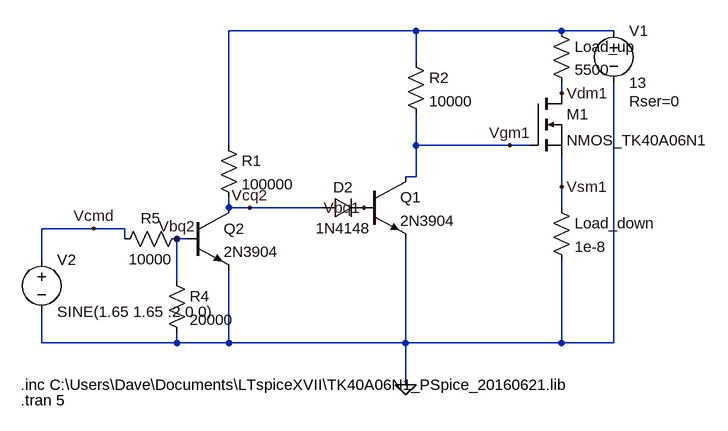
[diagram p0: schematic Acourse_MOSFET_201710112.asc]
Acourse_MOSFET_201710112.asc, the LTspice schematic file:
Version 4
SHEET 1 984 680
WIRE 320 -32 32 -32
WIRE 544 -32 320 -32
WIRE 624 -32 544 -32
WIRE 320 16 320 -32
WIRE 544 64 544 48
WIRE 32 144 32 -32
WIRE 320 144 320 96
WIRE 464 144 320 144
WIRE 496 144 464 144
WIRE 320 192 320 144
WIRE 320 192 304 192
WIRE 544 208 544 160
WIRE 32 240 32 224
WIRE 64 240 32 240
WIRE 176 240 64 240
WIRE 544 240 544 208
WIRE -176 272 -256 272
WIRE -128 272 -176 272
WIRE -128 288 -128 272
WIRE -32 288 -48 288
WIRE -256 320 -256 272
WIRE -48 352 -48 288
WIRE -256 448 -256 400
WIRE -48 448 -48 432
WIRE -48 448 -256 448
WIRE 32 448 32 336
WIRE 32 448 -48 448
WIRE 304 448 304 288
WIRE 304 448 32 448
WIRE 544 448 544 320
WIRE 544 448 304 448
WIRE 624 448 624 48
WIRE 624 448 544 448
WIRE 304 512 304 448
FLAG 304 512 0
FLAG -48 288 Vbq2
FLAG 240 240 Vbq1
FLAG 464 144 Vgm1
FLAG -176 272 Vcmd
FLAG 544 208 Vsm1
FLAG 544 64 Vdm1
FLAG 64 240 Vcq2
SYMBOL res 16 128 R0
SYMATTR InstName R1
SYMATTR Value 100000
SYMBOL res 304 0 R0
SYMATTR InstName R2
SYMATTR Value 10000
SYMBOL diode 176 256 R270
WINDOW 0 32 32 VTop 2
WINDOW 3 0 32 VBottom 2
SYMATTR InstName D2
SYMATTR Value 1N4148
SYMBOL npn 240 192 R0
SYMATTR InstName Q1
SYMATTR Value 2N3904
SYMBOL res 528 224 R0
SYMATTR InstName Load_down
SYMATTR Value 1e-8
SYMATTR SpiceLine pwr=200
SYMBOL voltage 624 -48 R0
WINDOW 123 0 0 Left 2
WINDOW 39 24 124 Left 2
SYMATTR SpiceLine Rser=0
SYMATTR InstName V1
SYMATTR Value 13
SYMBOL npn -32 240 R0
SYMATTR InstName Q2
SYMATTR Value 2N3904
SYMBOL res -64 336 R0
SYMATTR InstName R4
SYMATTR Value 20000
SYMBOL res -32 272 R90
WINDOW 0 0 56 VBottom 2
WINDOW 3 32 56 VTop 2
SYMATTR InstName R5
SYMATTR Value 10000
SYMBOL voltage -256 304 R0
WINDOW 123 0 0 Left 2
WINDOW 39 0 0 Left 2
SYMATTR InstName V2
SYMATTR Value SINE(1.65 1.65 .2 0 0)
SYMBOL nmos 496 64 R0
SYMATTR InstName M1
SYMATTR Value NMOS_TK40A06N1
SYMATTR Prefix X
SYMBOL res 528 -48 R0
SYMATTR InstName Load_up
SYMATTR Value 5500
TEXT -288 536 Left 2 !.tran 5
TEXT -288 512 Left 2 !.inc C:\\Users\\Dave\\Documents\\LTspiceXVII\\TK40A06N1_PSpice_20160621.lib

The netlist it stands for:
* Acourse_MOSFET_201710112.asc
R1 N001 Vcq2 100000
R2 N001 Vgm1 10000
D2 Vcq2 Vbq1 1N4148
Q1 Vgm1 Vbq1 0 0 2N3904
R§Load_down Vsm1 0 1e-8 pwr=200
V1 N001 0 13 Rser=0
Q2 Vcq2 Vbq2 0 0 2N3904
R4 Vbq2 0 20000
R5 Vbq2 Vcmd 10000
V2 Vcmd 0 SINE(1.65 1.65 .2 0 0)
XM1 Vdm1 Vgm1 Vsm1 NMOS_TK40A06N1  ; pins D G S
R§Load_up N001 Vdm1 5500
.model D D
.lib standard.dio
.model NPN NPN
.model PNP PNP
.lib standard.bjt
.tran 5
.inc C:\Users\Dave\Documents\LTspiceXVII\TK40A06N1_PSpice_20160621.lib
.backanno
.end